# Altium schematic sheet RFID Sheet2.SchDoc
size A4; SheetNumber: 2; SheetTotal: 2
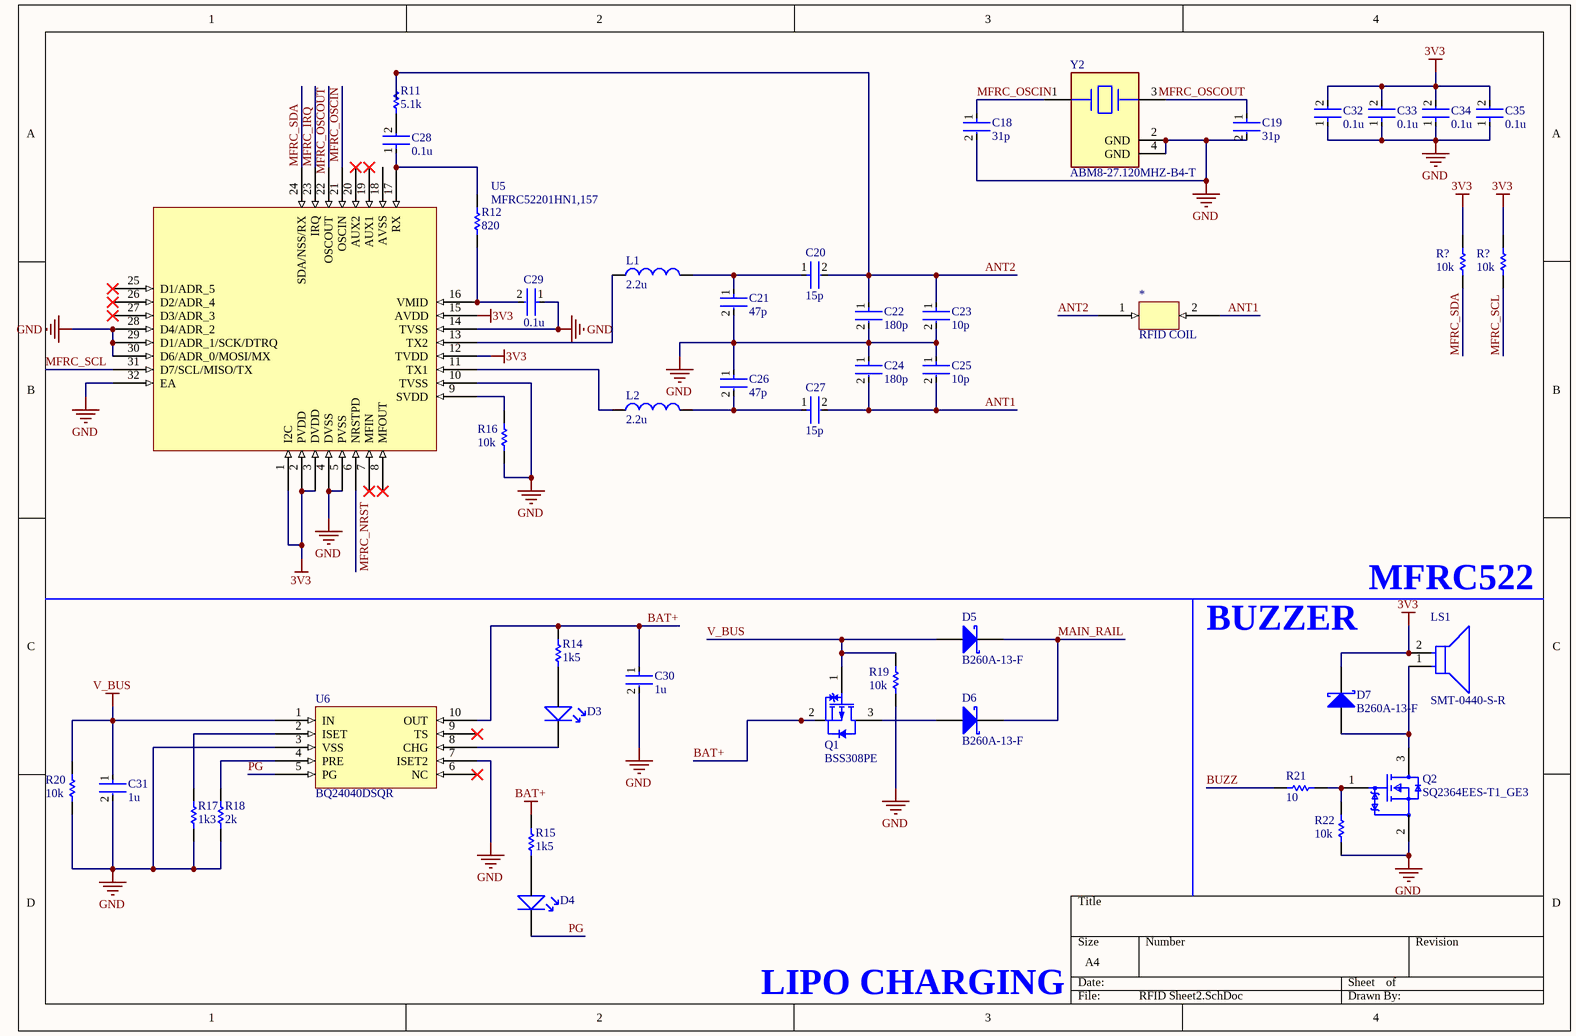
[diagram p0: RFID Sheet2.SchDoc]

## Parts
(Parts that share a designator on the sheet are numbered #1, #2 ... from top to bottom, then left to right.)
*  RFID COIL  [PCBComponent_1]
C18  31p  [FP-C0603C-CF-MFG]
C19  31p  [FP-C0603C-CF-MFG]
C20  15p  [FP-C0603C-CF-MFG]
C21  47p  [FP-C0603C-CF-MFG]
C22  180p  [FP-C0603C-CF-MFG]
C23  10p  [FP-C0603C-CF-MFG]
C24  180p  [FP-C0603C-CF-MFG]
C25  10p  [FP-C0603C-CF-MFG]
C26  47p  [FP-C0603C-CF-MFG]
C27  15p  [FP-C0603C-CF-MFG]
C28  0.1u  [FP-C0603C-CF-MFG]
C29  0.1u  [FP-C0603C-CF-MFG]
C30  1u  [FP-C0603C-CF-MFG]
C31  1u  [FP-C0603C-CF-MFG]
C32  0.1u  [FP-C0603C-CF-MFG]
C33  0.1u  [FP-C0603C-CF-MFG]
C34  0.1u  [FP-C0603C-CF-MFG]
C35  0.1u  [FP-C0603C-CF-MFG]
D3  0603 LED  [0603 LED]  (value not drawn)
D4  0603 LED  [0603 LED]  (value not drawn)
D5  B260A-13-F  [DIOD-SMA-2_V]
D6  B260A-13-F  [DIOD-SMA-2_V]
D7  B260A-13-F  [DIOD-SMA-2_V]
L1  2.2u  [INDC1608X90X30LL10T20]
L2  2.2u  [INDC1608X90X30LL10T20]
LS1  SMT-0440-S-R  [FP-SMT-0440-S-R-MFG]
Q1  BSS308PE  [INF-PG-SOT23_L]
Q2  SQ2364EES-T1_GE3  [FP-S-03946-MFG]
R11  5.1k  [RESC1609X50X30NL8T20]
R12  820  [RESC1609X50X30NL8T20]
R14  1k5  [RESC1609X50X30NL8T20]
R15  1k5  [RESC1609X50X30NL8T20]
R16  10k  [RESC1609X50X30NL8T20]
R17  1k3  [RESC1609X50X30NL8T20]
R18  2k  [RESC1609X50X30NL8T20]
R19  10k  [RESC1609X50X30NL8T20]
R20  10k  [RESC1609X50X30NL8T20]
R21  10  [RESC1609X50X30NL8T20]
R22  10k  [RESC1609X50X30NL8T20]
R?#1  10k  [RESC1609X50X30NL8T20]
R?#2  10k  [RESC1609X50X30NL8T20]
U5  MFRC52201HN1,157  [MFRC522]
U6  BQ24040DSQR  [BQ24040DSQR]
Y2  ABM8-27.120MHZ-B4-T  [FP-ABM8-MFG]

## Nets
3V3: C32.2 C33.2 C34.2 C35.2 D7.2(K) LS1.2(A) R?#1.2 R?#2.2 U5.1(I2C) U5.2(PVDD) U5.3(DVDD) U5.12(TVDD) U5.15(AVDD)
BAT+: C30.1 Q1.2(SOURCE) R14.2 R15.2 U6.10(OUT)
GND: C18.2 C19.2 C21.2 C22.2 C23.2 C24.1 C25.1 C26.1 C29.1 C30.2 C31.2 C32.1 C33.1 C34.1 C35.1 Q2.2(S) R16.1 R17.1 R18.1 R19.1 R20.1 R22.1 U5.4(DVSS) U5.5(PVSS) U5.10(TVSS) U5.14(TVSS) U5.28(D4/ADR_2) U5.29(D1/ADR_1/SCK/DTRQ) U5.30(D6/ADR_0/MOSI/MX) U5.32(EA) U6.3(VSS) U6.7(ISET2) Y2.2(GND) Y2.4(GND)
V_BUS: C31.1 D5.1(A) Q1.1(GATE) R19.2 R20.2 U6.1(IN)
ANT1: *.2 C24.2 C25.2 C27.2
ANT2: *.1 C20.2 C22.1 C23.1 R11.2
BUZZ: R21.2
MAIN_RAIL: D5.2(K) D6.2(K)
MFRC_IRQ: U5.23(IRQ)
MFRC_NRST: U5.6(NRSTPD)
MFRC_OSCIN: C18.1 U5.21(OSCIN) Y2.1
MFRC_OSCOUT: C19.1 U5.22(OSCOUT) Y2.3
MFRC_SCL: R?#2.1 U5.31(D7/SCL/MISO/TX)
MFRC_SDA: R?#1.1 U5.24(SDA/NSS/RX)
PG: D4.2 U6.5(PG)
NetC20_1: C20.1 C21.1 L1.2
NetC26_2: C26.2 C27.1 L2.2
NetC28_1: C28.1 R12.2 U5.17(RX)
NetC28_2: C28.2 R11.1
NetC29_2: C29.2 R12.1 U5.16(VMID)
NetD3_1: D3.1 R14.1
NetD3_2: D3.2 U6.8(CHG)
NetD4_1: D4.1 R15.1
NetD6_1: D6.1(A) Q1.3(DRAIN)
NetD7_1: D7.1(A) LS1.1(C) Q2.3(D)
NetL1_1: L1.1 U5.13(TX2)
NetL2_1: L2.1 U5.11(TX1)
NetQ2_1: Q2.1(G) R21.1 R22.2
NetR16_2: R16.2 U5.9(SVDD)
NetR17_2: R17.2 U6.2(ISET)
NetR18_2: R18.2 U6.4(PRE)

Not connected (* = marked no-connect by the designer): U5 7(MFIN)* 8(MFOUT)* 18(AVSS) 19(AUX1)* 20(AUX2)* 25(D1/ADR_5)* 26(D2/ADR_4)* 27(D3/ADR_3)*; U6 6(NC)* 9(TS)*

## Notes on the sheet
- BUZZER
- MFRC522
- LIPO CHARGING

## Library data of the parts
C18-C35 = CMP-2006-03061-2: CAP CER 0.1UF 50V X7R 0603; Manufacturer: KEMET; Manufacturer Part Number: C0603C104K5RACTU; Tolerance: 0.1; Temperature Coefficient: 30ppm/°C; Material: Ceramic; Automotive Grade: Grade 1; Value: 0.10 μF; Temperature: -55°C to +125°C; RoHS: TRUE; Temperature Range High: +125°C; Lead Free: Yes; Octopart: https://octopart.com/c0603c104k5ractu-kemet-139244; Digikey Description: CAP CER 0.1UF 50V X7R 0603; Category: Cap; Package: C0603C-CF; ComponentLink2Description: Datasheet; Temperature Range Low: -55°C; Device Class L1: Passive Components; Voltage Rating: 50 V; Automotive: Yes; Device Class L3: Ceramic Capacitors; ComponentLink2URL: https://api.kemet.com/component-edge/download/datasheet/C0603C100J5GACAUTO.pdf; Capacitance: 0.10 μF; Device Class L2: Capacitors; Temperature Characteristic: X7R; Height: 0.87mm
D5-D7 = CMP-2000-04933-1: Schottky Barrier Rectifier, 60 V, 2 A, -65 to 150 degC, 2-Pin SMA, RoHS, Tape and Reel; If - Forward Current: 2A; Vf - Forward Voltage: 0.7V; Ir - Reverse Current: 500uA; Configuration: Single; Unit Weight: 0.002258oz; Brand: DiodesIncorporated; Vrrm - Repetitive Reverse Voltage: 60V; Ifsm - Forward Surge Current: 50A; Product Category: SchottkyDiodes&Rectifiers; Datasheet Version: Rev. 22-2, 07/2015; Maximum Operating Temperature: +150C; Product: SchottkyDiodes; Minimum Operating Temperature: -65C; Operating Temperature Range: -65Cto+150C; Termination Style: SMD/SMT; Package / Case: SMA; Factory Pack Quantity: 5000; Technology: Si; Height: 2.1mm; Type: SchottkyBarrierRectifier; Manufacturer URL: http://www.diodes.com/; Datasheet URL: http://www.diodes.com/_files/datasheets/ds13004.pdf; RoHS: True; Mounting Style: SMD/SMT; Length: 4.6mm; Series: B260; Package Reference: SMA-2; Packaging: Reel; Width: 2.92mm; Manufacturer: DiodesIncorporated; Package Description: 2-Pin Surface Mounted Assembly, Body 4.3 x 2.605 mm, Height 2.4 mm
L1 L2 = CMP-2000-05913-1: Unshielded Wirewound Inductor, 33 nH, 350 mA, -55 to 150 degC, 0603 (1608 Metric), RoHS, Tape and Reel; Manufacturer: EPCOS-(TDK); Q @ Freq: 14@100MHz; Inductance: 33nH; Material - Core: Ceramic; Frequency - Self Resonant: 3GHz; DC Resistance (DCR): 600mOhmMax; Tolerance: ±5%; Frequency - Test: 100MHz; Current Rating: 350mA; Manufacturer URL: http://www.tdk.com/; Type: Wirewound; Mounting Type: SurfaceMount; Mounting Technology: SurfaceMount; Height - Seated (Max): 0.035"(0.90mm); Datasheet URL: https://en.tdk.eu/inf/30/db/ind_2008/b82496c.pdf; Shielding: Unshielded; Operating Temperature: -; Size / Dimension: 0.063"Lx0.031"W(1.60mmx0.80mm); Series: SIMID; Current - Saturation: -; Ratings: AEC-Q200; Packaging: CutTape(CT); Package Reference: 0603; Datasheet Version: 07/2016; Category: Inductors,Coils,Chokes; Package Description: 2-Pin Surface Mount Device, Body 1.6 x 0.8 mm; Family: FixedInductors; Package / Case: 0603(1608Metric)
LS1 = CMP-103888-000001-1: AUDIO MAGNETIC XDCR 2-4V SMD; Frequency: 4kHz; Voltage Rating: 3V; Operating Supply Current: 90mA; Mount: Surface Mount; Sensing Method: Magnetic; Termination: Solder; Width: 4mm; Packaging: Tape and Reel; Length: 4mm; Min Operating Temperature: -20°C; Max Operating Temperature: 70°C
Q1 = CMP-1099-00030-1: P-Channel OptiMOS P3 Small-Signal-Transistor, -30 V VDS, -2 A ID, -55 to 150 degC, PG-SOT23, Reel, Green; Manufacturer: Infineon; RDS (on) (max) (@4.5V): 130Â mOhm; Pto t (max): 0.5Â W; ID (max): -2Â A; IDpuls (max): -8Â A; VDS (max): -30Â V; VGS(th) (min): -2Â V; Green: TRUE; RDS (on) (max): 80Â mOhm; QG: -5Â nC; Rth: 250Â K/W; VGS(th) (max): -1Â V; PartNumber: BSS308PE; ComponentLink3Description: Package Specification; PackageDescription: 3-Pin Small Outline Transistor Package, 2.9 x 1.3 mm Body, 0.95 mm Pitch; Mounting Technology: Surface Mount; Packing: Reel; PackageReference: PG-SOT23; PackageVersion: Apr-08; Halogen-free: TRUE; DatasheetVersion: Rev. 2.03; ComponentLink2URL: http://www.infineon.com/dgdl/BSS308PE_Rev23_.pdf?folderId=db3a304314dca38901154a72e3951a65&fileId=db3a304330f686060131099c80400073; ComponentLink2Description: Datasheet; ComponentLink1Description: Manufacturer URL; ComponentLink1URL: http://www.infineon.com/; ComponentLink3URL: http://www.infineon.com/dgdl/SOT23-Package_Overview.pdf?folderId=db3a30431936bc4b0119532290053c66&fileId=db3a30431936bc4b0119533468123c85
Q2 = CMP-02550-000257-1: MOSFET N-CH 60V 2A SOT23-3
R11 R12 R14-R22 R?#1 R?#2 = CMP-1666-00005-4: Chip Resistor, 10 KOhm, +/- 1%, 100 mW, -55 to 155 degC, 0603 (1608 Metric), RoHS, Tape and Reel; Manufacturer: Vishay Semiconductor; Voltage Rating: 75 V; Max Operating Temperature: 155 degC; PackageDescription: 2-Pin Surface Mount Device, Body 1.575 x 0.85 mm; ComponentLink1Description: Manufacturer URL; RoHSCompliant: true; PackageReference: 0603; REACH SVHC: Unknown; Length: 1.55 mm; DatasheetVersion: 06/2012; Packaging: Tape and Reel; Min Operating Temperature: -55 degC; Mounting Technology: Surface Mount; ComponentLink2URL: https://datasheet.ciiva.com/11809/0900766b80d98afc-11809037.pdf; Height: 0.45 mm; ComponentLink2Description: Datasheet; Package Quantity: 5000; ComponentLink1URL: http://www.vishay.com/
Y2 = CMP-27762-000994-1: Crystal 27.12MHz ±30ppm 18pF SMD-4 3.2mm x 2.5mm; ESR (Equivalent Series Resistance): 50R; Frequency Stability: 50ppm; Capacitance: 1.8E-11F; Height: 0.031inch; Load Capacitance: 18pF; Width: 0.098inch; Packaging: Tape and Reel; Lead Free: Lead Free; Frequency Tolerance: 30ppm; Max Operating Temperature: 70°C; Length: 0.126inch; Case/Package: SMD/SMT; Mount: Surface Mount; Min Operating Temperature: -20°C; RoHS Compliant: Yes; Frequency: 27.12MHz